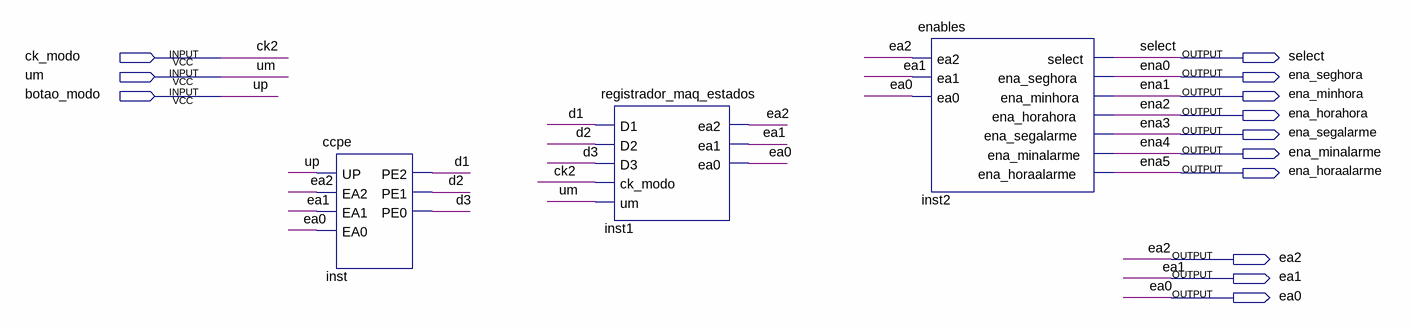
[diagram p0: schematic sheet]
// Quartus schematic maquina_estados.bdf as structural Verilog: 3 symbols, 13 pins
module maquina_estados (
  input  ck_modo,
  input  um,
  input  botao_modo,
  output select,
  output ena_seghora,
  output ena_minhora,
  output ena_horahora,
  output ena_segalarme,
  output ena_minalarme,
  output ena_horaalarme,
  output ea2,
  output ea1,
  output ea0
);

  wire d1, d2, d3;

  ccpe inst (.UP(botao_modo), .EA2(ea2), .EA1(ea1), .EA0(ea0), .PE2(d1), .PE1(d2), .PE0(d3));
  registrador_maq_estados inst1 (
    .D1(d1), .D2(d2), .D3(d3), .ck_modo(ck_modo), .um(um), .ea2(ea2), .ea1(ea1), .ea0(ea0));
  enables inst2 (
    .ea2(ea2), .ea1(ea1), .ea0(ea0), .select(select), .ena_seghora(ena_seghora), .ena_minhora(ena_minhora),
    .ena_horahora(ena_horahora), .ena_segalarme(ena_segalarme), .ena_minalarme(ena_minalarme),
    .ena_horaalarme(ena_horaalarme));

  // Other names for the same wires on the sheet: ck2 = ck_modo; ena0 = ena_seghora; ena1 = ena_minhora;
  //   ena2 = ena_horahora; ena3 = ena_segalarme; ena4 = ena_minalarme; ena5 = ena_horaalarme; up = botao_modo
endmodule
